# EAGLE schematic schematic (EAGLE 9.6.0)
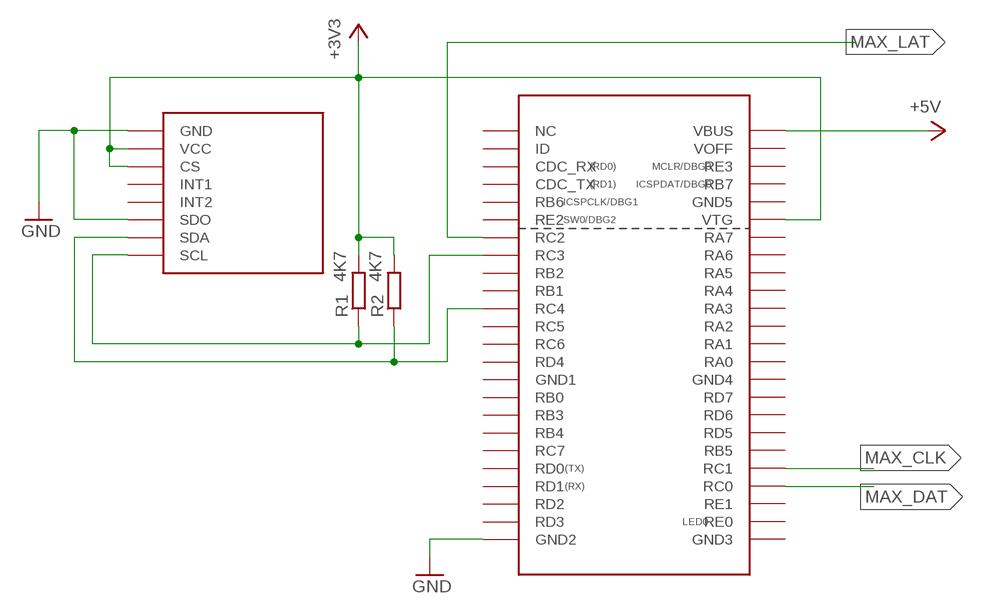
[diagram p0: schematic, sheet 1]

## Parts
R1  4K7  R-EU_0204/5  [0204/5]
R2  4K7  R-EU_0204/5  [0204/5]
U$1  PIC16F15376_CURIOSITY_NANO  [48PIN_CURIOSITY_NANO]
U$2  ADXL345_SPARKFUN  [ADXL345_SPARKFUN]

## Nets
+3V3: R1.2 R2.2 U$1.P$43(VTG) U$2.P$2(VCC) U$2.P$3(CS)
+5V: U$1.P$48(VBUS)
GND: U$1.P$24(GND2) U$2.P$1(GND) U$2.P$6(SDO)
MAX_CLK: U$1.P$29(RC1)
MAX_DAT: U$1.P$28(RC0)
MAX_LAT: U$1.P$7(RC2)
N$9: R2.1 U$1.P$11(RC4) U$2.P$7(SDA)
N$10: R1.1 U$1.P$8(RC3) U$2.P$8(SCL)
Unconnected: U$1.P$1(NC) U$1.P$2(ID) U$1.P$3(CDC_RX) U$1.P$4(CDC_TX) U$1.P$5(RB6) U$1.P$6(RE2) U$1.P$9(RB2) U$1.P$10(RB1) U$1.P$12(RC5) U$1.P$13(RC6) U$1.P$14(RD4) U$1.P$16(RB0) U$1.P$17(RB3) U$1.P$18(RB4) U$1.P$19(RC7) U$1.P$20(RD0) U$1.P$21(RD1) U$1.P$22(RD2) U$1.P$23(RD3) U$1.P$25(GND3) U$1.P$26(RE0) U$1.P$27(RE1) U$1.P$30(RB5) U$1.P$31(RD5) U$1.P$32(RD6) U$1.P$33(RD7) U$1.P$34(GND4) U$1.P$35(RA0) U$1.P$36(RA1) U$1.P$37(RA2) U$1.P$38(RA3) U$1.P$39(RA4) U$1.P$40(RA5) U$1.P$41(RA6) U$1.P$42(RA7) U$1.P$45(RB7) U$1.P$46(RE3) U$2.P$4(INT1) U$2.P$5(INT2)

## Power pins joined to a net without a drawn wire
GND1: U$1.P$15(GND1)
GND5: U$1.P$44(GND5)
VOFF: U$1.P$47(VOFF)

## Library data of the parts
R1 R2 = rcl:R-EU_: RESISTOR, European symbol; SPICEPREFIX: R
U$1 = PIC16F15376_CURIOSITY_NANO:PIC16F15376_CURIOSITY_NANO
U$2 = ADXL345_sparkfun:ADXL345_SPARKFUN